# EAGLE design SparkFun_VoiceBox_Shield (EAGLE 7.2.0)
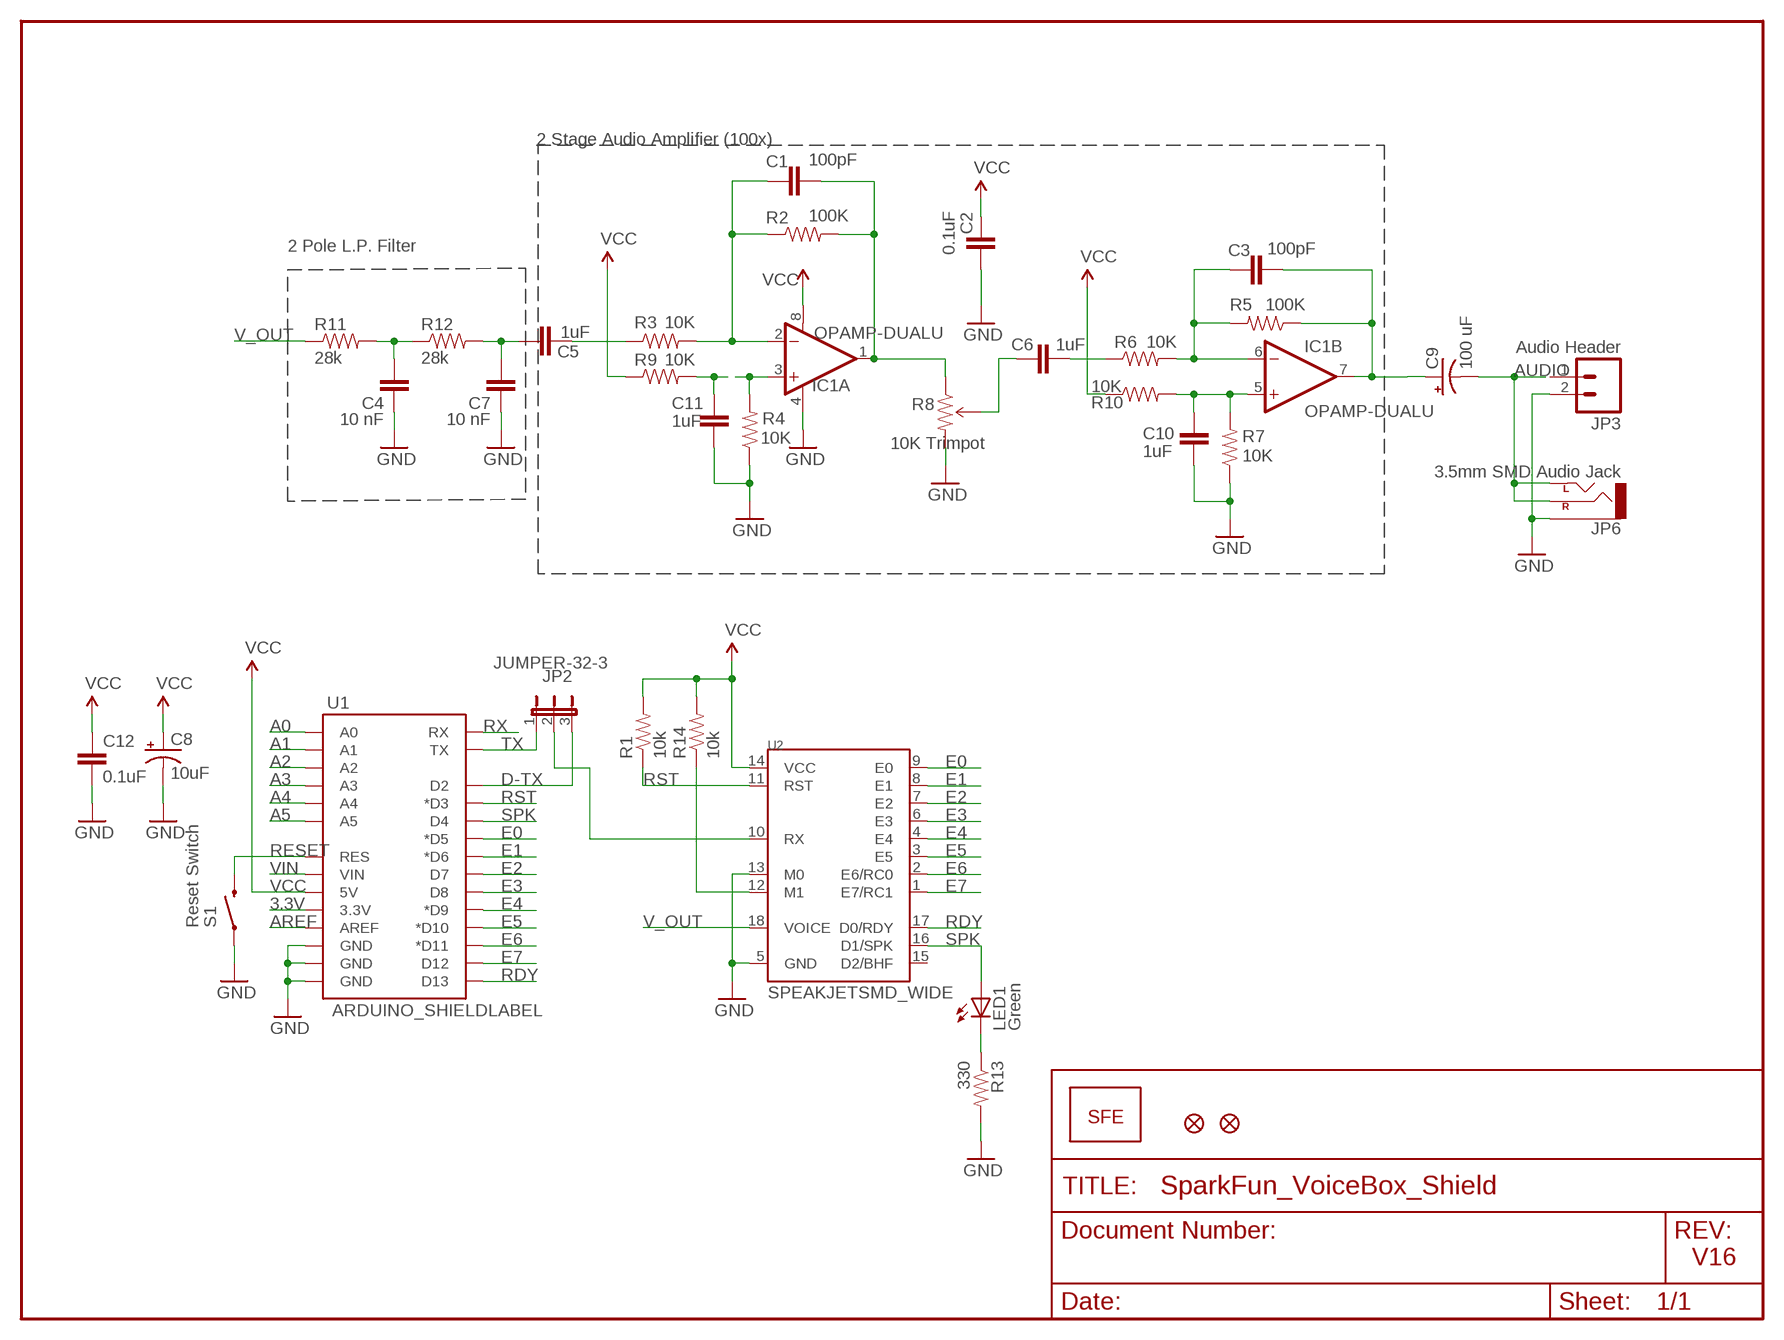
[diagram p0: schematic, sheet 1]

## Parts
C1  100pF  CAP0603-CAP  [0603-CAP]
C2  0.1uF  CAP0603-CAP  [0603-CAP]
C3  100pF  CAP0603-CAP  [0603-CAP]
C4  10 nF  CAP0603-CAP  [0603-CAP]
C5  1uF  CAP0603-CAP  [0603-CAP]
C6  1uF  CAP0603-CAP  [0603-CAP]
C7  10 nF  CAP0603-CAP  [0603-CAP]
C8  10uF  CAP_POL1206  [EIA3216]
C9  100 uF  CAP_POL7343  [EIA7343]
C10  1uF  CAP0603-CAP  [0603-CAP]
C11  1uF  CAP0603-CAP  [0603-CAP]
C12  0.1uF  CAP0603-CAP  [0603-CAP]
IC1  OPAMP-DUALU  [SO08]
JP1  LOGO-SFENEW  [SFE-NEW-WEBLOGO]
JP2  JUMPER-32-3  [SJ_3_PASTE2&3]
JP3  Audio Header  M02PTH  [1X02]
JP4  FIDUCIAL1X2  [FIDUCIAL-1X2]
JP5  FIDUCIAL1X2  [FIDUCIAL-1X2]
JP6  3.5mm SMD Audio Jack  AUDIO-JACKSMD2  [AUDIO-JACK-3.5MM-SMD]
LED1  Green  LED0603  [LED-0603]
R1  10k  RESISTOR0603-RES  [0603-RES]
R2  100K  RESISTOR0603-RES  [0603-RES]
R3  10K  RESISTOR0603-RES  [0603-RES]
R4  10K  RESISTOR0603-RES  [0603-RES]
R5  100K  RESISTOR0603-RES  [0603-RES]
R6  10K  RESISTOR0603-RES  [0603-RES]
R7  10K  RESISTOR0603-RES  [0603-RES]
R8  10K Trimpot  TRIMPOTSMD  [TRIMPOT-3MM]
R9  10K  RESISTOR0603  [0603]
R10  10K  RESISTOR0603  [0603]
R11  28k  RESISTOR0603-RES  [0603-RES]
R12  28k  RESISTOR0603-RES  [0603-RES]
R13  330  RESISTOR0603-RES  [0603-RES]
R14  10k  RESISTOR0603-RES  [0603-RES]
S1  Reset Switch  SWITCH-MOMENTARY-2SMD  [TACTILE_SWITCH_SMD]
U1  ARDUINO_SHIELDLABEL  [DUEMILANOVE_SHIELD]
U2  SPEAKJETSMD_WIDE  [SO-18W]

## Nets
3.3V: U1.3.3V
A0: U1.A0
A1: U1.A1
A2: U1.A2
A3: U1.A3
A4: U1.A4
A5: U1.A5
AREF: U1.AREF
AUDIO: C9.C(-) JP3.1 JP6.RING(RIGHT) JP6.TIP(LEFT)
D-TX: JP2.3 U1.D2
E0: U1.D5(*D5) U2.9(E0)
E1: U1.D6(*D6) U2.8(E1)
E2: U1.D7 U2.7(E2)
E3: U1.D8 U2.6(E3)
E4: U1.D9(*D9) U2.4(E4)
E5: U1.D10(*D10) U2.3(E5)
E6: U1.D11(*D11) U2.2(E6/RC0)
E7: U1.D12 U2.1(E7/RC1)
GND: C2.2 C4.1 C7.1 C8.C(-) C10.2 C11.2 C12.2 IC1.4(A:V-) JP3.2 JP6.SLEEVE R4.1 R7.1 R8.3(CW) R13.2 S1.1 U1.GND@0(GND) U1.GND@1(GND) U1.GND@2(GND) U2.5(GND) U2.13(M0)
IN1: C5.2 R3.1
N$3: JP2.2 U2.10(RX)
N$4: C1.1 IC1.2(A:-IN) R2.1 R3.2
N$5: C6.1 R6.1
N$6: C6.2 R8.2(WIPER)
N$7: C3.1 IC1.6(B:-IN) R5.2 R6.2
N$8: C10.1 IC1.5(B:+IN) R7.2 R10.2
N$9: C11.1 IC1.3(A:+IN) R4.2 R9.2
N$10: C4.2 R11.2 R12.1
N$11: C5.1 C7.2 R12.2
N$13: LED1.C R13.1
N$15: R14.1 U2.12(M1)
OUT1: C1.2 IC1.1(A:OUT) R2.2 R8.1(CCW)
RDY: U1.D13 U2.17(D0/RDY)
RESET: S1.3 U1.RES
RST: R1.1 U1.D3(*D3) U2.11(RST)
RX: U1.RX
SPK: LED1.A U1.D4 U2.16(D1/SPK)
SPK+: C3.2 C9.A(+) IC1.7(B:OUT) R5.1
TX: JP2.1 U1.TX
V_OUT: R11.1 U2.18(VOICE)
VCC: C2.1 C8.A(+) C12.1 IC1.8(A:V+) R1.2 R9.1 R10.1 R14.2 U1.5V U2.14(VCC)
VIN: U1.VIN
Unconnected: U2.15(D2/BHF)

## Notes on the sheet
- 2 Stage Audio Amplifier (100x)
- 2 Pole L.P. Filter
- V16

## Library data of the parts
C1-C7 C10-C12 = SparkFun:CAP: Capacitor Standard 0603 ceramic capacitor, and 0.1" leaded capacitor.
C8 C9 = SparkFun:CAP_POL: Capacitor Polarized These are standard SMD and PTH capacitors. Normally 10uF, 47uF, and 100uF in electrolytic and tantalum varieties. Always verify the external diameter of the through hole cap, it varies with capacity, voltage, and manufacturer. The EIA devices should be standard.
IC1 = SparkFun:OPAMP-DUAL: Operational Amplifier
JP1 = SparkFun:LOGO-SFE: Spark Fun Electronics PCB Logo This is the standard Spark Fun Electronics PCB logo.
JP2 = SparkFun:JUMPER-3
JP3 = SparkFun:M02: Header 2 Standard 2-pin 0.1" header. Use with straight break away headers (SKU : PRT-00116), right angle break away headers (PRT-00553), swiss pins (PRT-00743), machine pins (PRT-00117), and female headers (PRT-00115). Molex polarized connector foot print use with SKU : PRT-08233 with associated crimp pins and housings.
JP4 JP5 = SparkFun:FIDUCIAL: Fiducial Alignment Points Various fiducial points for machine vision alignment.
JP6 = SparkFun:AUDIO-JACK: 3.5mm Audio Jack Simple 3.5mm common PCB mount audio jack. SKU: PRT-08032
LED1 = SparkFun:LED: LEDs Standard schematic elements and footprints for 5mm, 3mm, 1206, and 0603 sized LEDs. 5mm - Spark Fun Electronics SKU : COM-00529 (and others)
R1-R7 R11-R14 = SparkFun:RESISTOR: Resistor Basic schematic elements and footprints for 0603, 1206, and PTH 1/10th watt (small) resistors.
R8 = SparkFun:TRIMPOT
R9 R10 = SparkFun-DC:RESISTOR: Resistor Basic schematic elements and footprints for 0603, 1206, and PTH 1/10th watt (small) resistors.
S1 = SparkFun:SWITCH-MOMENTARY-2
U1 = SparkFun:ARDUINO_SHIELD
U2 = SparkFun:SPEAKJET

## Board
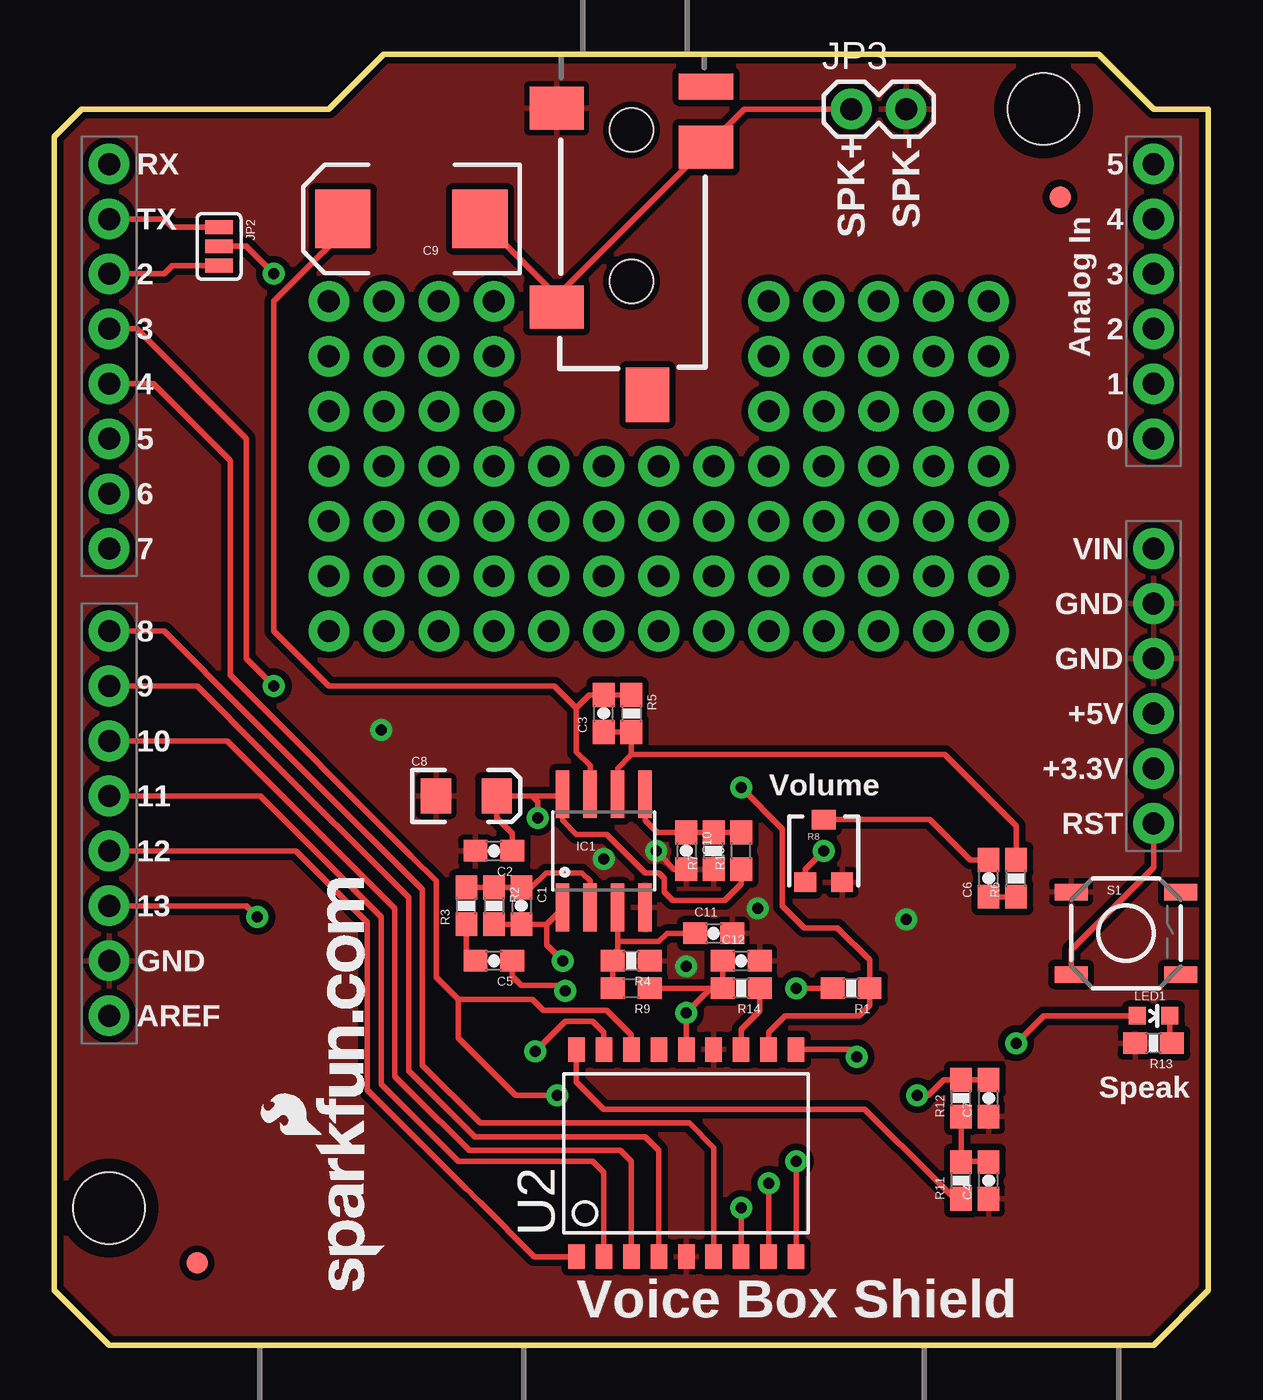
[diagram p1: board, top side]
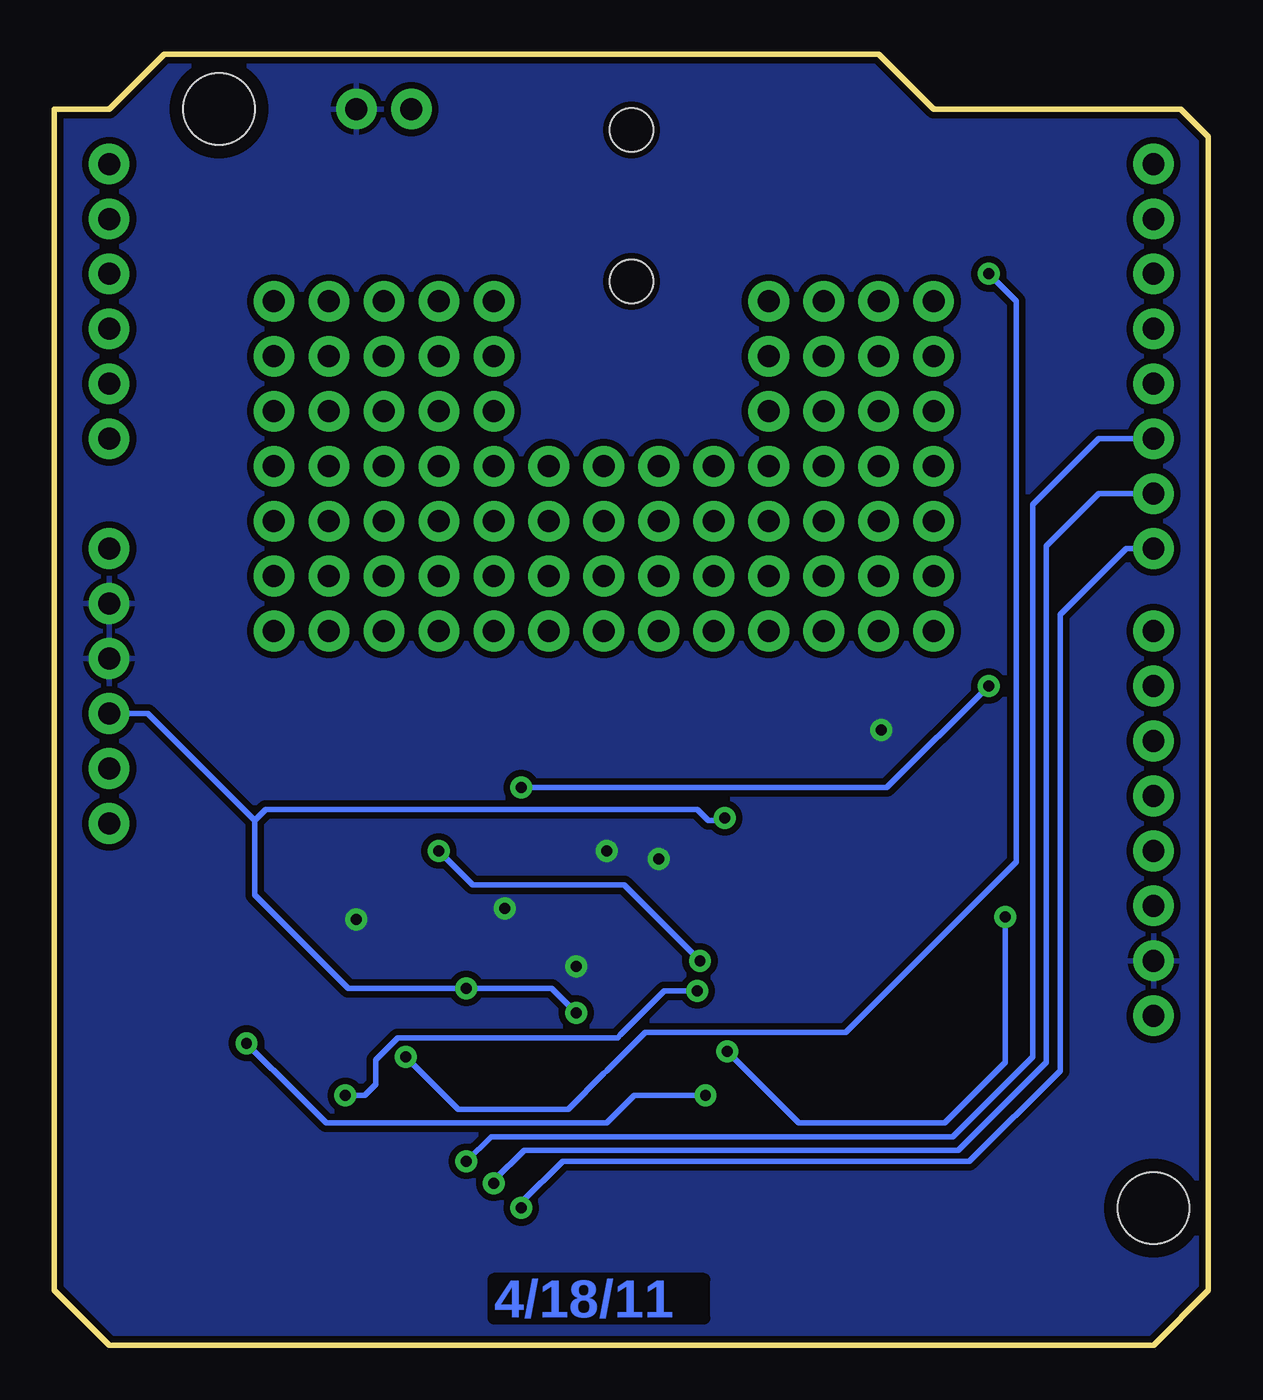
[diagram p2: board, bottom side, seen from below]

Size 53.34 x 59.69 mm. Coordinates in mm from the lower left corner, seen from the top.
Outline: 2.54,0 0,2.54 0,55.88 1.27,57.15 12.7,57.15 15.24,59.69 48.26,59.69 50.8,57.15 53.34,57.15 53.34,2.54 50.8,0 2.54,0
Copper layers (1*16): Top 0.035mm / dielectric 1.5mm / Bottom 0.035mm
Design rules "SparkFun *": minimum track width 8mil, minimum drill 20mil, track to track 8mil, track to pad 8mil, pad to pad 8mil, via to via 8mil, smd to smd 8mil, copper to edge 9mil, drill to drill 8mil, minimum pad ring 12mil, minimum via ring 10mil, stop-mask expansion 4mil, vias tented up to drill 20mil, thermal gap 10mil

### Footprints (pad centres in the part's own frame; a part is rotated, then mirrored left to right if it is on the bottom)
0603-CAP = smd 1.1 x 1: 1 -0.85,0; 2 0.85,0
EIA3216 = smd 1.4 x 1.6: A 1.4,0; C -1.4,0
EIA7343 = smd 2.55 x 2.7: A 3.17,0; C -3.17,0
SO08 = smd 0.61 x 2.21: 1 -1.905,-2.616; 2 -0.635,-2.616; 3 0.635,-2.616; 4 1.905,-2.616; 5 1.905,2.616; 6 0.635,2.616; 7 -0.635,2.616; 8 -1.905,2.616
SJ_3_PASTE2&3 = smd 0.635 x 1.27: 1 -0.889,0; 2 0,0; 3 0.889,0
1X02 = drill 1.016 pad 1.88: 1 0,0; 2 2.54,0
FIDUCIAL-1X2 = smd 1 x 1: 1 0,0
AUDIO-JACK-3.5MM-SMD = smd 2 x 2.5: RING 4.3,3.45; SLEEVE 2.5,-3.45; TIP 11.7,-3.45 | smd 1.2 x 2.5: RSH 1.5,3.45 | smd 2.5 x 2: TSH 15.75,0.75 | hole 2: 3.5,0; 10.5,0
LED-0603 = smd 0.8 x 0.8: A 0,-0.75; C 0,0.75
0603-RES = smd 1.1 x 1: 1 -0.85,0; 2 0.85,0
TRIMPOT-3MM = smd 1 x 0.9: 1 -0.85,-1.45; 3 0.85,-1.45 | smd 1.1 x 0.9: 2 0,1.45
0603 = smd 1.1 x 1: 1 -0.85,0; 2 0.85,0
TACTILE_SWITCH_SMD = smd 1.524 x 0.762: 1 -2.54,1.905; 2 2.54,1.905; 3 -2.54,-1.905; 4 2.54,-1.905
DUEMILANOVE_SHIELD = drill 1.016 pad 1.88: 3.3V 50.8,26.67; 5V 50.8,29.21; A0 50.8,41.91; A1 50.8,44.45; A2 50.8,46.99; A3 50.8,49.53; A4 50.8,52.07; A5 50.8,54.61; AREF 2.54,15.24; D2 2.54,49.53; D3 2.54,46.99; D4 2.54,44.45; D5 2.54,41.91; D6 2.54,39.37; D7 2.54,36.83; D8 2.54,33.02; D9 2.54,30.48; D10 2.54,27.94; D11 2.54,25.4; D12 2.54,22.86; D13 2.54,20.32; GND@0 50.8,31.75; GND@1 50.8,34.29; GND@2 2.54,17.78; RES 50.8,24.13; RX 2.54,54.61; TX 2.54,52.07; VIN 50.8,36.83 | hole 3.302: 45.72,57.15; 2.54,6.35
SO-18W = smd 0.762 x 1.143: 1 -5.08,-4.788; 2 -3.81,-4.788; 3 -2.54,-4.788; 4 -1.27,-4.788; 5 0,-4.788; 6 1.27,-4.788; 7 2.54,-4.788; 8 3.81,-4.788; 9 5.08,-4.788; 10 5.08,4.788; 11 3.81,4.788; 12 2.54,4.788; 13 1.27,4.788; 14 0,4.788; 15 -1.27,4.788; 16 -2.54,4.788; 17 -3.81,4.788; 18 -5.08,4.788

### Placement (x,y rotation side)
C1  21.59,20.32 270 top
C2  20.32,22.86 180 top
C3  25.4,29.21 90 top
C4  43.18,7.62 90 top
C5  20.32,17.78 180 top
C6  43.18,21.59 90 top
C7  43.18,11.43 90 top
C8  19.05,25.4 0 top
C9  16.51,52.07 180 top
C10  29.21,22.86 270 top
C11  30.48,19.05 0 top
C12  31.75,17.78 0 top
IC1  25.4,22.86 0 top
JP1  15.24,2.54 90 top
JP2  7.62,50.8 270 top
JP3  36.83,57.15 0 top
JP4  46.48,53.09 0 top
JP5  6.6,3.81 0 top
JP6  26.67,59.69 270 top
LED1  50.8,15.24 270 top
R1  36.83,16.51 180 top
R2  20.32,20.32 270 top
R3  19.05,20.32 90 top
R4  26.67,17.78 180 top
R5  26.67,29.21 270 top
R6  44.45,21.59 90 top
R7  30.48,22.86 90 top
R8  35.56,22.86 0 top
R9  26.67,16.51 180 top
R10  31.75,22.86 90 top
R11  41.91,7.62 90 top
R12  41.91,11.43 90 top
R13  50.8,13.97 180 top
R14  31.75,16.51 180 top
S1  49.53,19.05 0 top
U1  0,0 0 top
U2  29.21,8.89 0 top

### Tracks (layer width: path | path; a pad name or v marks a point on that pad's centre or on a via)
AUDIO
  Top 0.254: 22.95,48.26 22.86,48.26 | 22.95,48.26 JP6.TIP 22.95,48.26 | C9.C 22.86,48.89 22.86,48.26 | 22.95,48.26 22.86,48.26 | 22.86,48.26 22.99,48.26 JP6.RING 31.88,57.15 JP3.1
D-TX
  Top 0.254: U1.D2 5.08,49.53 5.46,49.91 JP2.3
E0  (via drill 0.51)
  Top 0.254: v34.29,8.51 U2.9
  Bottom 0.254: U1.D5 5.08,41.91 8.13,38.86 8.13,28.7 8.13,19.68 8.13,13.34 11.81,9.65 31.11,9.65 31.88,9.65 32.38,9.65 33.15,9.65 v34.29,8.51
E1  (via drill 0.51)
  Top 0.254: v33.02,7.49 U2.8
  Bottom 0.254: U1.D6 5.08,39.37 7.49,36.96 7.49,26.8 7.49,17.65 7.49,13.08 11.56,9.02 30.35,9.02 31.11,9.02 31.62,9.02 33.02,7.62 v33.02,7.49
E2  (via drill 0.51)
  Top 0.254: v31.75,6.35 U2.7
  Bottom 0.254: U1.D7 3.81,36.83 6.86,33.78 6.86,24.89 6.86,16.13 6.86,12.7 11.05,8.51 29.59,8.51 29.84,8.51 31.75,6.6 v31.75,6.35
E3
  Top 0.254: U1.D8 5.08,33.02 8.89,29.21 17.02,21.08 17.02,13.59 17.02,12.95 19.68,10.29 28.32,10.29 28.57,10.29 29.08,10.29 29.34,10.29 30.48,9.14 U2.6
E4
  Top 0.254: U1.D9 6.6,30.48 9.65,27.43 16.38,20.7 16.38,17.27 16.38,12.7 17.65,11.43 19.43,9.65 20.95,9.65 23.88,9.65 27.05,9.65 27.3,9.65 27.94,9.02 U2.4
E5
  Top 0.254: U1.D10 8,27.94 9.14,26.8 15.75,20.19 15.75,17.4 15.75,12.45 16.51,11.68 19.18,9.02 21.84,9.02 23.11,9.02 26.04,9.02 26.16,9.02 26.67,8.51 U2.3
E6
  Top 0.254: U1.D11 9.53,25.4 10.67,24.26 15.11,19.81 15.11,16.51 15.11,12.06 16.38,10.79 18.67,8.51 20.45,8.51 20.7,8.51 24.26,8.51 24.77,8.51 24.89,8.51 25.4,8 U2.2
E7
  Top 0.254: U1.D12 11.18,22.86 12.19,21.84 14.48,19.56 14.48,17.65 14.48,11.81 16.13,10.16 19.05,7.24 19.18,7.11 19.41,6.88 19.68,6.6 22.19,4.1 U2.1
GND  (via drill 0.51)
  Top 0.254: v27.81,22.86 27.94,22.73 28.66,22.01 C10.2
  other vias: 25.4,22.48 32.51,20.19 29.21,17.53 39.37,19.68 15.11,28.45
  pour Bottom (isolate 0.305): 0,2.54 0,55.88 1.27,57.15 12.7,57.15 15.24,59.69 48.26,59.69 50.8,57.15 53.34,57.15 53.34,2.54 50.8,0 2.54,0
  pour Top (isolate 0.305): 0,2.54 0,55.88 1.27,57.15 12.7,57.15 15.24,59.69 48.26,59.69 50.8,57.15 53.34,57.15 53.34,2.54 50.8,0 2.54,0
IN1
  Top 0.254: C5.2 19.47,17.87 19.43,17.91 19.05,18.29 R3.1
N$3  (via drill 0.51)
  Top 0.254: JP2.2 8.89,50.8 v10.16,49.53 | 36.91,13.51 v37.08,13.34 36.83,13.59 36.74,13.68 U2.10
  Bottom 0.254: v10.16,49.53 8.89,48.26 8.89,44.96 8.89,22.35 14.73,16.51 16.76,14.48 21.59,14.48 26.04,14.48 27.81,12.7 27.94,12.57 29.59,10.92 34.29,10.92 34.67,10.92 v37.08,13.34
N$4
  Top 0.254: IC1.2 24.77,21.46 24.38,21.84 24.26,21.84 22.73,21.84 22.06,21.17 C1.1 21.5,21.17 21.46,21.21 21.42,21.17 R2.1 20.32,21.21 20.28,21.17 R3.2
N$5
  Top 0.254: R6.1 44.23,20.74 44.2,20.7 44.16,20.74 C6.1
N$6
  Top 0.254: R8.2 40.46,24.31 41.91,22.86 42.33,22.44 C6.2
N$7
  Top 0.254: IC1.6 26.04,26.67 26.67,27.3 | 26.67,28.32 R5.2 26.67,28.32 | 26.67,27.3 26.67,28.32 | C3.1 26.63,28.36 26.67,28.32 | R6.2 44.45,24 41.15,27.3 26.8,27.3 26.67,27.3
N$8
  Top 0.254: R10.2 31.54,23.71 31.5,23.75 31.46,23.71 R7.2 30.31,23.71 30.23,23.62 30.14,23.71 C10.1 27.85,23.71 27.81,23.75 27.3,24.26 IC1.5
N$9
  Top 0.254: 26.04,18.67 26.04,18.29 25.78,18.03 25.82,18 R4.2 26.04,17.78 25.82,17.57 R9.2 | 26.04,18.67 IC1.3 | C11.1 28.32,19.05 27.94,18.67 26.04,18.67
N$10
  Top 0.254: R11.2 41.91,8.51 | 41.91,8.51 R12.1 | C4.2 42.97,8.47 42.93,8.51 41.91,8.51
N$11  (via drill 0.51)
  Top 0.254: C7.2 42.2,12.28 42.16,12.32 42.12,12.28 R12.2 41.11,12.28 41.02,12.19 40.39,11.56 v39.88,11.56 | C5.1 21.17,17.06 21.59,16.64 23.37,16.64 v23.62,16.38
  Bottom 0.254: v39.88,11.56 38.99,11.56 38.48,12.06 38.48,13.21 37.47,14.22 27.3,14.22 27.18,14.35 25.15,16.38 v23.62,16.38
N$13
  Top 0.254: R13.1 51.65,14.01 51.56,14.1 51.55,14.11 LED1.C
N$15
  Top 0.254: U2.12 31.75,14.61 32.51,15.37 32.6,15.46 R14.1
N$16  (via drill 1.02 pad 1.88)
  other vias: 12.7,33.02
N$17  (via drill 1.02 pad 1.88)
  other vias: 15.24,33.02
N$18  (via drill 1.02 pad 1.88)
  other vias: 17.78,33.02
N$19  (via drill 1.02 pad 1.88)
  other vias: 20.32,33.02
N$20  (via drill 1.02 pad 1.88)
  other vias: 22.86,33.02
N$21  (via drill 1.02 pad 1.88)
  other vias: 27.94,33.02
N$22  (via drill 1.02 pad 1.88)
  other vias: 30.48,33.02
N$23  (via drill 1.02 pad 1.88)
  other vias: 33.02,33.02
N$24  (via drill 1.02 pad 1.88)
  other vias: 35.56,33.02
N$25  (via drill 1.02 pad 1.88)
  other vias: 38.1,33.02
N$26  (via drill 1.02 pad 1.88)
  other vias: 40.64,33.02
N$27  (via drill 1.02 pad 1.88)
  other vias: 43.18,33.02
N$28  (via drill 1.02 pad 1.88)
  other vias: 43.18,35.56
N$29  (via drill 1.02 pad 1.88)
  other vias: 40.64,35.56
N$30  (via drill 1.02 pad 1.88)
  other vias: 38.1,35.56
N$31  (via drill 1.02 pad 1.88)
  other vias: 35.56,35.56
N$32  (via drill 1.02 pad 1.88)
  other vias: 33.02,35.56
N$33  (via drill 1.02 pad 1.88)
  other vias: 30.48,35.56
N$34  (via drill 1.02 pad 1.88)
  other vias: 27.94,35.56
N$35  (via drill 1.02 pad 1.88)
  other vias: 25.4,35.56
N$36  (via drill 1.02 pad 1.88)
  other vias: 22.86,35.56
N$37  (via drill 1.02 pad 1.88)
  other vias: 20.32,35.56
N$38  (via drill 1.02 pad 1.88)
  other vias: 17.78,35.56
N$39  (via drill 1.02 pad 1.88)
  other vias: 15.24,35.56
N$40  (via drill 1.02 pad 1.88)
  other vias: 12.7,35.56
N$41  (via drill 1.02 pad 1.88)
  other vias: 12.7,38.1
N$42  (via drill 1.02 pad 1.88)
  other vias: 15.24,38.1
N$43  (via drill 1.02 pad 1.88)
  other vias: 17.78,38.1
N$44  (via drill 1.02 pad 1.88)
  other vias: 20.32,38.1
N$45  (via drill 1.02 pad 1.88)
  other vias: 22.86,38.1
N$46  (via drill 1.02 pad 1.88)
  other vias: 25.4,38.1
N$47  (via drill 1.02 pad 1.88)
  other vias: 27.94,38.1
N$48  (via drill 1.02 pad 1.88)
  other vias: 30.48,38.1
N$49  (via drill 1.02 pad 1.88)
  other vias: 33.02,38.1
N$50  (via drill 1.02 pad 1.88)
  other vias: 35.56,38.1
N$51  (via drill 1.02 pad 1.88)
  other vias: 38.1,38.1
N$52  (via drill 1.02 pad 1.88)
  other vias: 40.64,38.1
N$53  (via drill 1.02 pad 1.88)
  other vias: 43.18,38.1
N$54  (via drill 1.02 pad 1.88)
  other vias: 43.18,40.64
N$55  (via drill 1.02 pad 1.88)
  other vias: 40.64,40.64
N$56  (via drill 1.02 pad 1.88)
  other vias: 38.1,40.64
N$57  (via drill 1.02 pad 1.88)
  other vias: 35.56,40.64
N$58  (via drill 1.02 pad 1.88)
  other vias: 33.02,40.64
N$59  (via drill 1.02 pad 1.88)
  other vias: 30.48,40.64
N$60  (via drill 1.02 pad 1.88)
  other vias: 27.94,40.64
N$61  (via drill 1.02 pad 1.88)
  other vias: 25.4,40.64
N$62  (via drill 1.02 pad 1.88)
  other vias: 22.86,40.64
N$63  (via drill 1.02 pad 1.88)
  other vias: 20.32,40.64
N$64  (via drill 1.02 pad 1.88)
  other vias: 17.78,40.64
N$65  (via drill 1.02 pad 1.88)
  other vias: 15.24,40.64
N$66  (via drill 1.02 pad 1.88)
  other vias: 12.7,40.64
N$67  (via drill 1.02 pad 1.88)
  other vias: 12.7,43.18
N$68  (via drill 1.02 pad 1.88)
  other vias: 15.24,43.18
N$69  (via drill 1.02 pad 1.88)
  other vias: 17.78,43.18
N$70  (via drill 1.02 pad 1.88)
  other vias: 20.32,43.18
N$75  (via drill 1.02 pad 1.88)
  other vias: 33.02,43.18
N$76  (via drill 1.02 pad 1.88)
  other vias: 35.56,43.18
N$77  (via drill 1.02 pad 1.88)
  other vias: 38.1,43.18
N$78  (via drill 1.02 pad 1.88)
  other vias: 40.64,43.18
N$79  (via drill 1.02 pad 1.88)
  other vias: 43.18,43.18
N$80  (via drill 1.02 pad 1.88)
  other vias: 43.18,45.72
N$81  (via drill 1.02 pad 1.88)
  other vias: 40.64,45.72
N$82  (via drill 1.02 pad 1.88)
  other vias: 38.1,45.72
N$83  (via drill 1.02 pad 1.88)
  other vias: 35.56,45.72
N$84  (via drill 1.02 pad 1.88)
  other vias: 33.02,45.72
N$89  (via drill 1.02 pad 1.88)
  other vias: 20.32,45.72
N$90  (via drill 1.02 pad 1.88)
  other vias: 17.78,45.72
N$91  (via drill 1.02 pad 1.88)
  other vias: 15.24,45.72
N$92  (via drill 1.02 pad 1.88)
  other vias: 12.7,45.72
N$93  (via drill 1.02 pad 1.88)
  other vias: 12.7,48.26
N$94  (via drill 1.02 pad 1.88)
  other vias: 17.78,48.26
N$95  (via drill 1.02 pad 1.88)
  other vias: 15.24,48.26
N$96  (via drill 1.02 pad 1.88)
  other vias: 20.32,48.26
N$101  (via drill 1.02 pad 1.88)
  other vias: 33.02,48.26
N$102  (via drill 1.02 pad 1.88)
  other vias: 35.56,48.26
N$103  (via drill 1.02 pad 1.88)
  other vias: 38.1,48.26
N$104  (via drill 1.02 pad 1.88)
  other vias: 40.64,48.26
N$105  (via drill 1.02 pad 1.88)
  other vias: 43.18,48.26
N$106  (via drill 1.02 pad 1.88)
  other vias: 25.4,33.02
OUT1  (via drill 0.51)
  Top 0.254: IC1.1 23.5,20.19 22.86,19.56 22.77,19.47 | 22.77,19.47 22.73,19.47 C1.2 21.59,19.43 21.55,19.47 R2.2 | 22.77,19.47 22.77,18.5 v23.5,17.78 | R8.1 34.71,22.01 v35.56,22.86
  Bottom 0.254: v23.5,17.78 27,21.29 33.98,21.29 v35.56,22.86
RDY  (via drill 0.51)
  Top 0.254: U1.D13 8.89,20.32 v9.4,19.81 | v22.23,13.59 23.62,14.99 24.26,14.99 24.51,14.99 24.89,14.99 25.4,14.48 U2.17
  Bottom 0.254: v9.4,19.81 9.4,13.08 10.92,11.56 12.19,10.29 13.34,10.29 18.03,10.29 18.92,10.29 v22.23,13.59
RESET
  Top 0.254: U1.RES 50.8,22.1 49.02,20.32 46.99,18.29 46.99,17.27 S1.3
RST  (via drill 0.51)
  Top 0.254: v31.75,25.78 33.66,23.88 33.66,20.32 34.67,19.3 36.2,19.3 37.68,17.82 R1.1 37.68,15.71 37.59,15.62 37.47,15.49 37.21,15.24 34.67,15.24 34.42,15.24 33.78,15.24 33.02,14.48 U2.11 | v10.16,30.48 8.89,31.75 8.89,33.27 8.89,41.91 3.81,46.99 U1.D3
  Bottom 0.254: v31.75,25.78 14.86,25.78 v10.16,30.48
SPK  (via drill 0.51)
  Top 0.254: 18.67,16 21.84,16 22.1,16 22.61,15.49 24.77,15.49 25.02,15.49 25.53,15.49 26.67,14.35 U2.16 | 18.67,16 17.65,17.02 17.65,21.46 16.51,22.61 8.13,30.99 8.13,36.7 8.13,40.89 4.57,44.45 4.32,44.45 U1.D4 | LED1.A 45.72,15.24 v44.45,13.97 | 18.67,16 18.67,14.22 21.34,11.56 v23.24,11.56
  Bottom 0.254: v44.45,13.97 42.04,11.56 40.77,10.29 28.45,10.29 27.81,10.29 26.54,11.56 v23.24,11.56
SPK+
  Top 0.254: IC1.7 24.77,26.8 24.13,27.43 24.13,27.69 24.13,29.46 | 24.13,29.46 24.73,30.06 C3.2 26.58,30.06 26.67,29.97 R5.1 | C9.A 13.34,51.44 11.43,49.53 10.16,48.26 10.16,46.99 10.16,33.02 11.43,31.75 12.7,30.48 16.51,30.48 23.11,30.48 24.13,29.46
TX
  Top 0.254: U1.TX 5.08,52.07 5.46,51.69 JP2.1
V_OUT
  Top 0.254: R11.1 41.62,6.77 41.02,7.37 40.77,7.62 37.47,10.92 37.34,10.92 36.96,10.92 26.29,10.92 26.16,10.92 25.4,10.92 24.13,12.19 U2.18
VCC  (via drill 0.51)
  Top 0.254: v34.29,16.51 R1.2 | R10.1 31.75,21.34 30.99,20.57 28.57,20.57 28.19,20.95 28.19,21.59 27.94,21.84 27.56,21.84 27.3,21.84 26.67,22.48 25.65,23.5 25.53,23.62 24.38,23.62 24.13,23.62 23.5,24.26 IC1.8 23.44,25.48 23.37,25.4 22.1,25.4 | 22.1,25.4 C8.A 20.45,24.38 20.57,24.26 21.17,23.66 C2.1 | C12.1 30.9,16.68 30.86,16.64 30.9,16.6 R14.2 30.86,16.51 | v22.35,24.38 22.35,25.15 22.1,25.4 | R9.1 30.86,16.51 | 30.86,16.51 30.35,16.51 v29.21,15.37 29.21,15.11 U2.14
  Bottom 0.254: U1.5V 49.02,29.21 44.07,24.26 | v22.35,24.38 22.48,24.26 23.11,24.26 23.62,24.77 43.56,24.77 44.07,24.26 | 44.07,24.26 44.07,24.13 44.07,20.83 39.75,16.51 v34.29,16.51 31.75,16.51 30.35,16.51 v29.21,15.37

### Text on the board
Bottom: 4/18/11
tPlace: SPK+ | SPK- | Volume | Speak | Voice Box Shield